# Altium project HE-PCB.PrjPcb
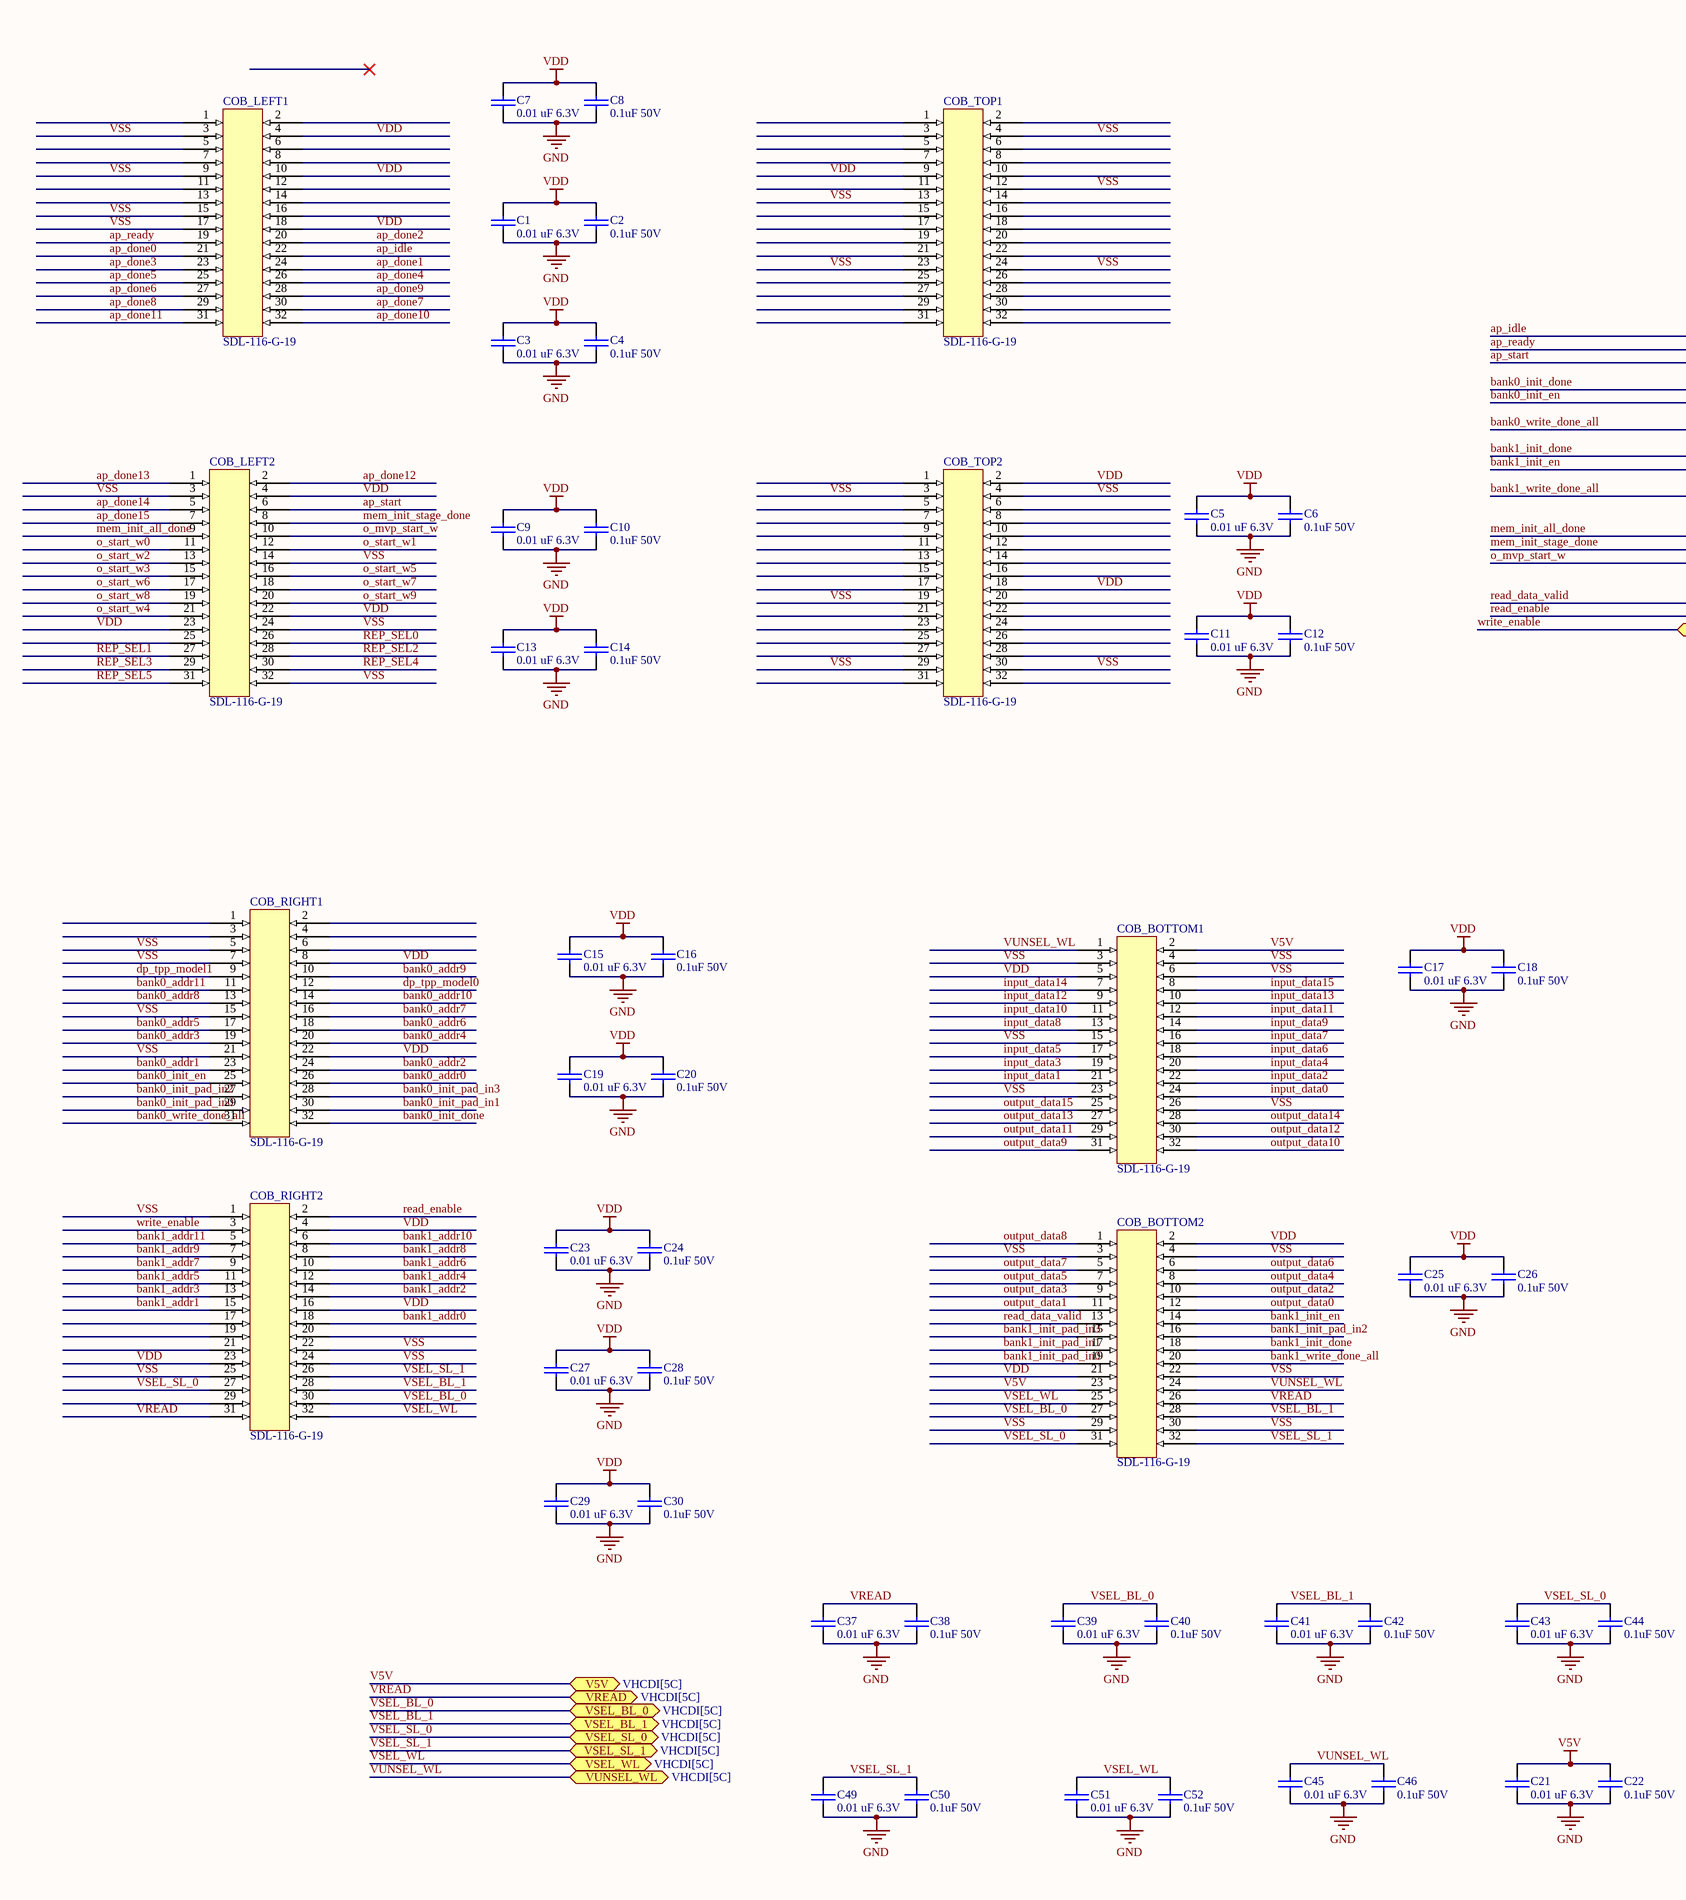
[diagram p0: COBConnector.SchDoc, left]
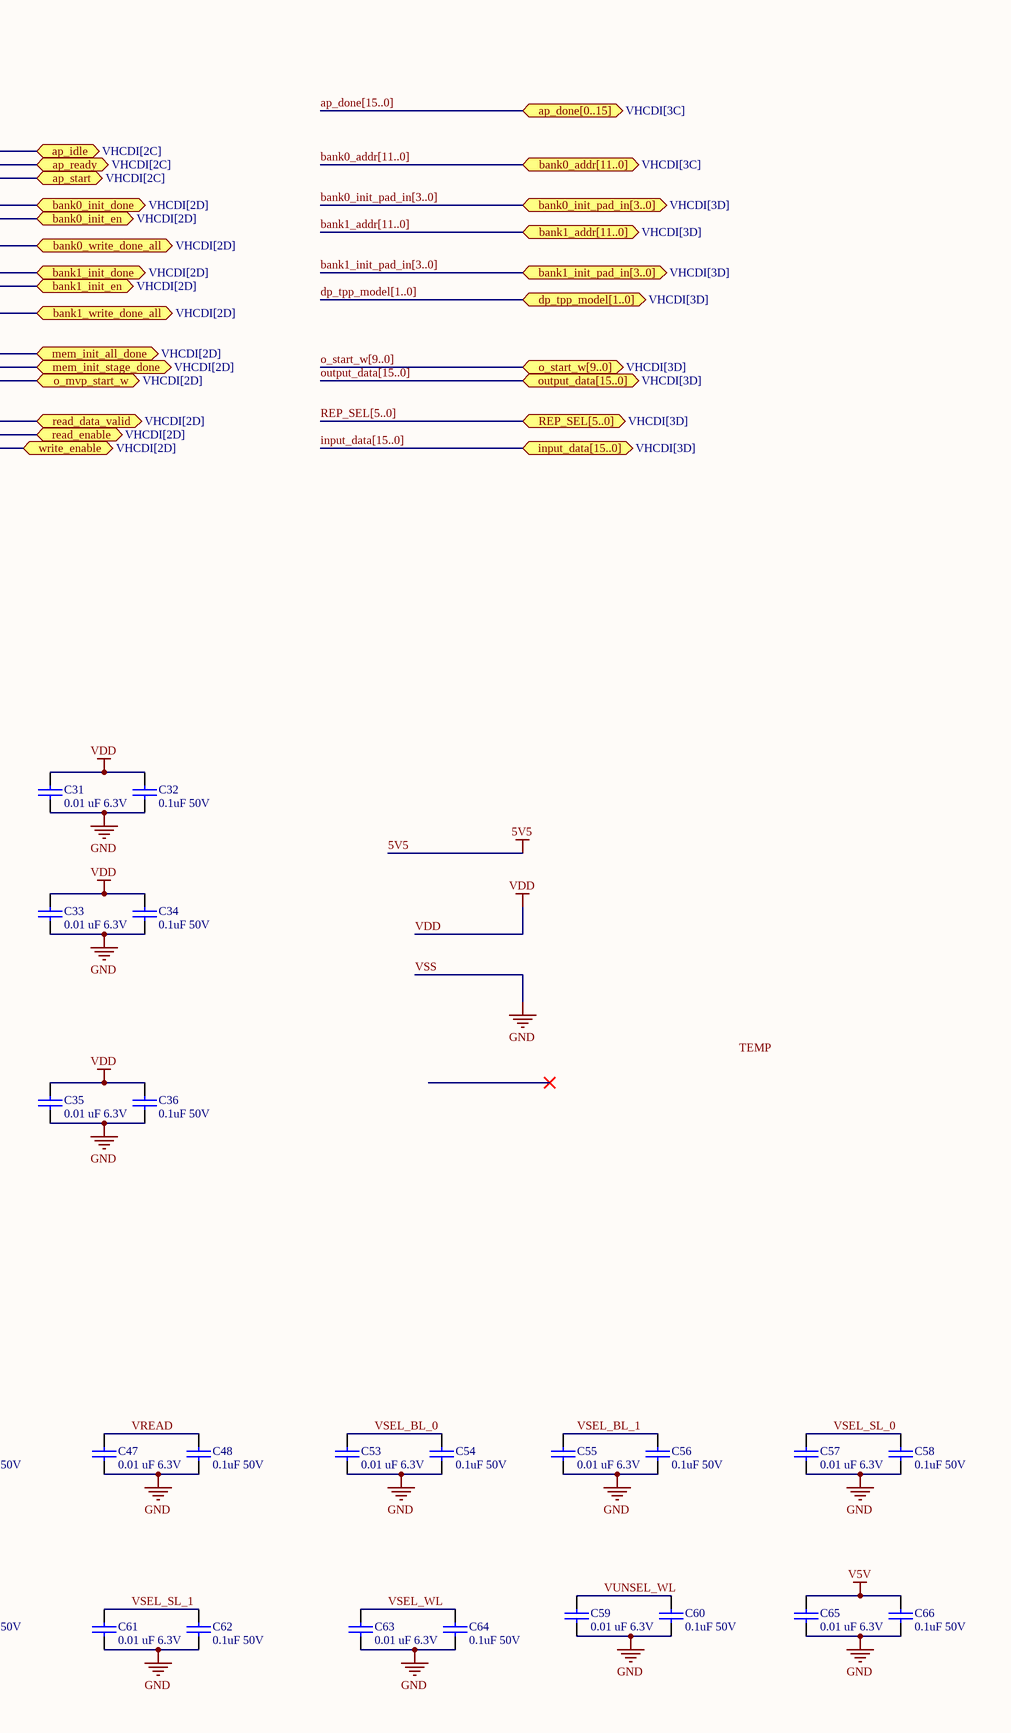
[diagram p1: COBConnector.SchDoc, right]
2 sheets, 79 parts. Net scope: flat (ports and power ports of the same name join across sheets).
Board file: HE.PcbDoc
Sheets:
  COBConnector.SchDoc
  VHCDI.SchDoc

## Sheet COBConnector.SchDoc
size C; SheetNumber: 1; SheetTotal: 2

### Parts
C1  0.01 uF 6.3V  [C0603-XXXXXX-XXX]
C2  0.1uF 50V  [C0603-XXXXXX-XXX]
C3  0.01 uF 6.3V  [C0603-XXXXXX-XXX]
C4  0.1uF 50V  [C0603-XXXXXX-XXX]
C5  0.01 uF 6.3V  [C0603-XXXXXX-XXX]
C6  0.1uF 50V  [C0603-XXXXXX-XXX]
C7  0.01 uF 6.3V  [C0603-XXXXXX-XXX]
C8  0.1uF 50V  [C0603-XXXXXX-XXX]
C9  0.01 uF 6.3V  [C0603-XXXXXX-XXX]
C10  0.1uF 50V  [C0603-XXXXXX-XXX]
C11  0.01 uF 6.3V  [C0603-XXXXXX-XXX]
C12  0.1uF 50V  [C0603-XXXXXX-XXX]
C13  0.01 uF 6.3V  [C0603-XXXXXX-XXX]
C14  0.1uF 50V  [C0603-XXXXXX-XXX]
C15  0.01 uF 6.3V  [C0603-XXXXXX-XXX]
C16  0.1uF 50V  [C0603-XXXXXX-XXX]
C17  0.01 uF 6.3V  [C0603-XXXXXX-XXX]
C18  0.1uF 50V  [C0603-XXXXXX-XXX]
C19  0.01 uF 6.3V  [C0603-XXXXXX-XXX]
C20  0.1uF 50V  [C0603-XXXXXX-XXX]
C21  0.01 uF 6.3V  [C0603-XXXXXX-XXX]
C22  0.1uF 50V  [C0603-XXXXXX-XXX]
C23  0.01 uF 6.3V  [C0603-XXXXXX-XXX]
C24  0.1uF 50V  [C0603-XXXXXX-XXX]
C25  0.01 uF 6.3V  [C0603-XXXXXX-XXX]
C26  0.1uF 50V  [C0603-XXXXXX-XXX]
C27  0.01 uF 6.3V  [C0603-XXXXXX-XXX]
C28  0.1uF 50V  [C0603-XXXXXX-XXX]
C29  0.01 uF 6.3V  [C0603-XXXXXX-XXX]
C30  0.1uF 50V  [C0603-XXXXXX-XXX]
C31  0.01 uF 6.3V  [C0603-XXXXXX-XXX]
C32  0.1uF 50V  [C0603-XXXXXX-XXX]
C33  0.01 uF 6.3V  [C0603-XXXXXX-XXX]
C34  0.1uF 50V  [C0603-XXXXXX-XXX]
C35  0.01 uF 6.3V  [C0603-XXXXXX-XXX]
C36  0.1uF 50V  [C0603-XXXXXX-XXX]
C37  0.01 uF 6.3V  [C0603-XXXXXX-XXX]
C38  0.1uF 50V  [C0603-XXXXXX-XXX]
C39  0.01 uF 6.3V  [C0603-XXXXXX-XXX]
C40  0.1uF 50V  [C0603-XXXXXX-XXX]
C41  0.01 uF 6.3V  [C0603-XXXXXX-XXX]
C42  0.1uF 50V  [C0603-XXXXXX-XXX]
C43  0.01 uF 6.3V  [C0603-XXXXXX-XXX]
C44  0.1uF 50V  [C0603-XXXXXX-XXX]
C45  0.01 uF 6.3V  [C0603-XXXXXX-XXX]
C46  0.1uF 50V  [C0603-XXXXXX-XXX]
C47  0.01 uF 6.3V  [C0603-XXXXXX-XXX]
C48  0.1uF 50V  [C0603-XXXXXX-XXX]
C49  0.01 uF 6.3V  [C0603-XXXXXX-XXX]
C50  0.1uF 50V  [C0603-XXXXXX-XXX]
C51  0.01 uF 6.3V  [C0603-XXXXXX-XXX]
C52  0.1uF 50V  [C0603-XXXXXX-XXX]
C53  0.01 uF 6.3V  [C0603-XXXXXX-XXX]
C54  0.1uF 50V  [C0603-XXXXXX-XXX]
C55  0.01 uF 6.3V  [C0603-XXXXXX-XXX]
C56  0.1uF 50V  [C0603-XXXXXX-XXX]
C57  0.01 uF 6.3V  [C0603-XXXXXX-XXX]
C58  0.1uF 50V  [C0603-XXXXXX-XXX]
C59  0.01 uF 6.3V  [C0603-XXXXXX-XXX]
C60  0.1uF 50V  [C0603-XXXXXX-XXX]
C61  0.01 uF 6.3V  [C0603-XXXXXX-XXX]
C62  0.1uF 50V  [C0603-XXXXXX-XXX]
C63  0.01 uF 6.3V  [C0603-XXXXXX-XXX]
C64  0.1uF 50V  [C0603-XXXXXX-XXX]
C65  0.01 uF 6.3V  [C0603-XXXXXX-XXX]
C66  0.1uF 50V  [C0603-XXXXXX-XXX]
COB_BOTTOM1  SDL-116-G-19  [CON32_2X16_TU_DSL_SAI]
COB_BOTTOM2  SDL-116-G-19  [CON32_2X16_TU_DSL_SAI]
COB_LEFT1  SDL-116-G-19  [CON32_2X16_TU_DSL_SAI]
COB_LEFT2  SDL-116-G-19  [CON32_2X16_TU_DSL_SAI]
COB_RIGHT1  SDL-116-G-19  [CON32_2X16_TU_DSL_SAI]
COB_RIGHT2  SDL-116-G-19  [CON32_2X16_TU_DSL_SAI]
COB_TOP1  SDL-116-G-19  [CON32_2X16_TU_DSL_SAI]
COB_TOP2  SDL-116-G-19  [CON32_2X16_TU_DSL_SAI]

### Ports
ap_done[0..15] (bidir, see VHCDI[3C]), ap_idle (bidir, see VHCDI[2C]), ap_ready (bidir, see VHCDI[2C]), ap_start (bidir, see VHCDI[2C]), bank0_addr[11..0] (bidir, see VHCDI[3C]), bank0_init_done (bidir, see VHCDI[2D]), bank0_init_en (bidir, see VHCDI[2D]), bank0_init_pad_in[3..0] (bidir, see VHCDI[3D]), bank0_write_done_all (bidir, see VHCDI[2D]), bank1_addr[11..0] (bidir, see VHCDI[3D]), bank1_init_done (bidir, see VHCDI[2D]), bank1_init_en (bidir, see VHCDI[2D]), bank1_init_pad_in[3..0] (bidir, see VHCDI[3D]), bank1_write_done_all (bidir, see VHCDI[2D]), dp_tpp_model[1..0] (bidir, see VHCDI[3D]), input_data[15..0] (bidir, see VHCDI[3D]), mem_init_all_done (bidir, see VHCDI[2D]), mem_init_stage_done (bidir, see VHCDI[2D]), o_mvp_start_w (bidir, see VHCDI[2D]), o_start_w[9..0] (bidir, see VHCDI[3D]), output_data[15..0] (bidir, see VHCDI[3D]), read_data_valid (bidir, see VHCDI[2D]), read_enable (bidir, see VHCDI[2D]), REP_SEL[5..0] (bidir, see VHCDI[3D]), V5V (bidir, see VHCDI[5C]), VREAD (bidir, see VHCDI[5C]), VSEL_BL_0 (bidir, see VHCDI[5C]), VSEL_BL_1 (bidir, see VHCDI[5C]), VSEL_SL_0 (bidir, see VHCDI[5C]), VSEL_SL_1 (bidir, see VHCDI[5C]), VSEL_WL (bidir, see VHCDI[5C]), VUNSEL_WL (bidir, see VHCDI[5C]), write_enable (bidir, see VHCDI[2D])

### Nets
V5V: C21.1 C22.1 C65.1 C66.1 COB_BOTTOM1.2 COB_BOTTOM2.23 ; port V5V
VDD: C1.1 C2.1 C3.1 C4.1 C5.1 C6.1 C7.1 C8.1 C9.1 C10.1 C11.1 C12.1 C13.1 C14.1 C15.1 C16.1 C17.1 C18.1 C19.1 C20.1 C23.1 C24.1 C25.1 C26.1 C27.1 C28.1 C29.1 C30.1 C31.1 C32.1 C33.1 C34.1 C35.1 C36.1 COB_BOTTOM1.5 COB_BOTTOM2.2 COB_BOTTOM2.21 COB_LEFT1.4 COB_LEFT1.10 COB_LEFT1.18 COB_LEFT2.4 COB_LEFT2.22 COB_LEFT2.23 COB_RIGHT1.8 COB_RIGHT1.22 COB_RIGHT2.4 COB_RIGHT2.16 COB_RIGHT2.23 COB_TOP1.9 COB_TOP2.2 COB_TOP2.18
VSS: C1.2 C2.2 C3.2 C4.2 C5.2 C6.2 C7.2 C8.2 C9.2 C10.2 C11.2 C12.2 C13.2 C14.2 C15.2 C16.2 C17.2 C18.2 C19.2 C20.2 C21.2 C22.2 C23.2 C24.2 C25.2 C26.2 C27.2 C28.2 C29.2 C30.2 C31.2 C32.2 C33.2 C34.2 C35.2 C36.2 C37.2 C38.2 C39.2 C40.2 C41.2 C42.2 C43.2 C44.2 C45.2 C46.2 C47.2 C48.2 C49.2 C50.2 C51.2 C52.2 C53.2 C54.2 C55.2 C56.2 C57.2 C58.2 C59.2 C60.2 C61.2 C62.2 C63.2 C64.2 C65.2 C66.2 COB_BOTTOM1.3 COB_BOTTOM1.4 COB_BOTTOM1.6 COB_BOTTOM1.15 COB_BOTTOM1.23 COB_BOTTOM1.26 COB_BOTTOM2.3 COB_BOTTOM2.4 COB_BOTTOM2.22 COB_BOTTOM2.29 COB_BOTTOM2.30 COB_LEFT1.3 COB_LEFT1.9 COB_LEFT1.15 COB_LEFT1.17 COB_LEFT2.3 COB_LEFT2.14 COB_LEFT2.24 COB_LEFT2.32 COB_RIGHT1.5 COB_RIGHT1.7 COB_RIGHT1.15 COB_RIGHT1.21 COB_RIGHT2.1 COB_RIGHT2.22 COB_RIGHT2.24 COB_RIGHT2.25 COB_TOP1.4 COB_TOP1.12 COB_TOP1.13 COB_TOP1.23 COB_TOP1.24 COB_TOP2.3 COB_TOP2.4 COB_TOP2.19 COB_TOP2.29 COB_TOP2.30  [also labelled GND]
ap_done0: COB_LEFT1.21
ap_done1: COB_LEFT1.24
ap_done2: COB_LEFT1.20
ap_done3: COB_LEFT1.23
ap_done4: COB_LEFT1.26
ap_done5: COB_LEFT1.25
ap_done6: COB_LEFT1.27
ap_done7: COB_LEFT1.30
ap_done8: COB_LEFT1.29
ap_done9: COB_LEFT1.28
ap_done10: COB_LEFT1.32
ap_done11: COB_LEFT1.31
ap_done12: COB_LEFT2.2
ap_done13: COB_LEFT2.1
ap_done14: COB_LEFT2.5
ap_done15: COB_LEFT2.7
ap_idle: COB_LEFT1.22 ; port ap_idle
ap_ready: COB_LEFT1.19 ; port ap_ready
ap_start: COB_LEFT2.6 ; port ap_start
bank0_addr0: COB_RIGHT1.26
bank0_addr1: COB_RIGHT1.23
bank0_addr2: COB_RIGHT1.24
bank0_addr3: COB_RIGHT1.19
bank0_addr4: COB_RIGHT1.20
bank0_addr5: COB_RIGHT1.17
bank0_addr6: COB_RIGHT1.18
bank0_addr7: COB_RIGHT1.16
bank0_addr8: COB_RIGHT1.13
bank0_addr9: COB_RIGHT1.10
bank0_addr10: COB_RIGHT1.14
bank0_addr11: COB_RIGHT1.11
bank0_init_done: COB_RIGHT1.32 ; port bank0_init_done
bank0_init_en: COB_RIGHT1.25 ; port bank0_init_en
bank0_init_pad_in0: COB_RIGHT1.29
bank0_init_pad_in1: COB_RIGHT1.30
bank0_init_pad_in2: COB_RIGHT1.27
bank0_init_pad_in3: COB_RIGHT1.28
bank0_write_done_all: COB_RIGHT1.31 ; port bank0_write_done_all
bank1_addr0: COB_RIGHT2.18
bank1_addr1: COB_RIGHT2.15
bank1_addr2: COB_RIGHT2.14
bank1_addr3: COB_RIGHT2.13
bank1_addr4: COB_RIGHT2.12
bank1_addr5: COB_RIGHT2.11
bank1_addr6: COB_RIGHT2.10
bank1_addr7: COB_RIGHT2.9
bank1_addr8: COB_RIGHT2.8
bank1_addr9: COB_RIGHT2.7
bank1_addr10: COB_RIGHT2.6
bank1_addr11: COB_RIGHT2.5
bank1_init_done: COB_BOTTOM2.18 ; port bank1_init_done
bank1_init_en: COB_BOTTOM2.14 ; port bank1_init_en
bank1_init_pad_in0: COB_BOTTOM2.19
bank1_init_pad_in1: COB_BOTTOM2.17
bank1_init_pad_in2: COB_BOTTOM2.16
bank1_init_pad_in3: COB_BOTTOM2.15
bank1_write_done_all: COB_BOTTOM2.20 ; port bank1_write_done_all
dp_tpp_model0: COB_RIGHT1.12
dp_tpp_model1: COB_RIGHT1.9
input_data0: COB_BOTTOM1.24
input_data1: COB_BOTTOM1.21
input_data2: COB_BOTTOM1.22
input_data3: COB_BOTTOM1.19
input_data4: COB_BOTTOM1.20
input_data5: COB_BOTTOM1.17
input_data6: COB_BOTTOM1.18
input_data7: COB_BOTTOM1.16
input_data8: COB_BOTTOM1.13
input_data9: COB_BOTTOM1.14
input_data10: COB_BOTTOM1.11
input_data11: COB_BOTTOM1.12
input_data12: COB_BOTTOM1.9
input_data13: COB_BOTTOM1.10
input_data14: COB_BOTTOM1.7
input_data15: COB_BOTTOM1.8
mem_init_all_done: COB_LEFT2.9 ; port mem_init_all_done
mem_init_stage_done: COB_LEFT2.8 ; port mem_init_stage_done
o_mvp_start_w: COB_LEFT2.10 ; port o_mvp_start_w
o_start_w0: COB_LEFT2.11
o_start_w1: COB_LEFT2.12
o_start_w2: COB_LEFT2.13
o_start_w3: COB_LEFT2.15
o_start_w4: COB_LEFT2.21
o_start_w5: COB_LEFT2.16
o_start_w6: COB_LEFT2.17
o_start_w7: COB_LEFT2.18
o_start_w8: COB_LEFT2.19
o_start_w9: COB_LEFT2.20
output_data0: COB_BOTTOM2.12
output_data1: COB_BOTTOM2.11
output_data2: COB_BOTTOM2.10
output_data3: COB_BOTTOM2.9
output_data4: COB_BOTTOM2.8
output_data5: COB_BOTTOM2.7
output_data6: COB_BOTTOM2.6
output_data7: COB_BOTTOM2.5
output_data8: COB_BOTTOM2.1
output_data9: COB_BOTTOM1.31
output_data10: COB_BOTTOM1.32
output_data11: COB_BOTTOM1.29
output_data12: COB_BOTTOM1.30
output_data13: COB_BOTTOM1.27
output_data14: COB_BOTTOM1.28
output_data15: COB_BOTTOM1.25
read_data_valid: COB_BOTTOM2.13 ; port read_data_valid
read_enable: COB_RIGHT2.2 ; port read_enable
REP_SEL0: COB_LEFT2.26
REP_SEL1: COB_LEFT2.27
REP_SEL2: COB_LEFT2.28
REP_SEL3: COB_LEFT2.29
REP_SEL4: COB_LEFT2.30
REP_SEL5: COB_LEFT2.31
VREAD: C37.1 C38.1 C47.1 C48.1 COB_BOTTOM2.26 COB_RIGHT2.31 ; port VREAD
VSEL_BL_0: C39.1 C40.1 C53.1 C54.1 COB_BOTTOM2.27 COB_RIGHT2.30 ; port VSEL_BL_0
VSEL_BL_1: C41.1 C42.1 C55.1 C56.1 COB_BOTTOM2.28 COB_RIGHT2.28 ; port VSEL_BL_1
VSEL_SL_0: C43.1 C44.1 C57.1 C58.1 COB_BOTTOM2.31 COB_RIGHT2.27 ; port VSEL_SL_0
VSEL_SL_1: C49.1 C50.1 C61.1 C62.1 COB_BOTTOM2.32 COB_RIGHT2.26 ; port VSEL_SL_1
VSEL_WL: C51.1 C52.1 C63.1 C64.1 COB_BOTTOM2.25 COB_RIGHT2.32 ; port VSEL_WL
VUNSEL_WL: C45.1 C46.1 C59.1 C60.1 COB_BOTTOM1.1 COB_BOTTOM2.24 ; port VUNSEL_WL
write_enable: COB_RIGHT2.3 ; port write_enable

Not connected (* = marked no-connect by the designer): COB_LEFT1 1 2 5 6 7 8 11 12 13 14 16; COB_LEFT2 25; COB_RIGHT1 1 2 3 4 6; COB_RIGHT2 17 19 20 21 29; COB_TOP1 1 2 3 5 6 7 8 10 11 14 15 16 17 18 19 20 21 22 25 26 27 28 29 30 31 32; COB_TOP2 1 5 6 7 8 9 10 11 12 13 14 15 16 17 20 21 22 23 24 25 26 27 28 31 32

### Buses and harness runs
bus ap_done[15..0] = port ap_done[0..15]
bus bank0_addr[11..0] = port bank0_addr[11..0]
bus bank0_init_pad_in[3..0] = port bank0_init_pad_in[3..0]
bus bank1_addr[11..0] = port bank1_addr[11..0]
bus bank1_init_pad_in[3..0] = port bank1_init_pad_in[3..0]
bus dp_tpp_model[1..0] = port dp_tpp_model[1..0]
bus input_data[15..0] = port input_data[15..0]
bus o_start_w[9..0] = port o_start_w[9..0]
bus output_data[15..0] = port output_data[15..0]
bus REP_SEL[5..0] = port REP_SEL[5..0]

### Notes on the sheet
- Labels drawn without touching a wire or pin: TEMP

### Library data of the parts
C1 C3 C5 C7 C9 C11 C13 C15 C17 C19 C21 C23 C25 C27 C29 C31 C33 C35 C37 C39 C41 C43 C45 C47 C49 C51 C53 C55 C57 C59 C61 C63 C65 = C0603F103M9RACTU: Multilayer Ceramic Capacitors MLCC - SMD/SMT 6.3V 0.01uF X7R 0603 20%; Value: 0.01 uF 6.3V
C2 C4 C6 C8 C10 C12 C14 C16 C18 C20 C22 C24 C26 C28 C30 C32 C34 C36 C38 C40 C42 C44 C46 C48 C50 C52 C54 C56 C58 C60 C62 C64 C66 = C0603C104M5RAC7867: 0.1 µF ±20% 50V Ceramic Capacitor X7R 0603; KMI: 821327; Value: 0.1uF 50V

## Sheet VHCDI.SchDoc
size C; SheetNumber: 2; SheetTotal: 2
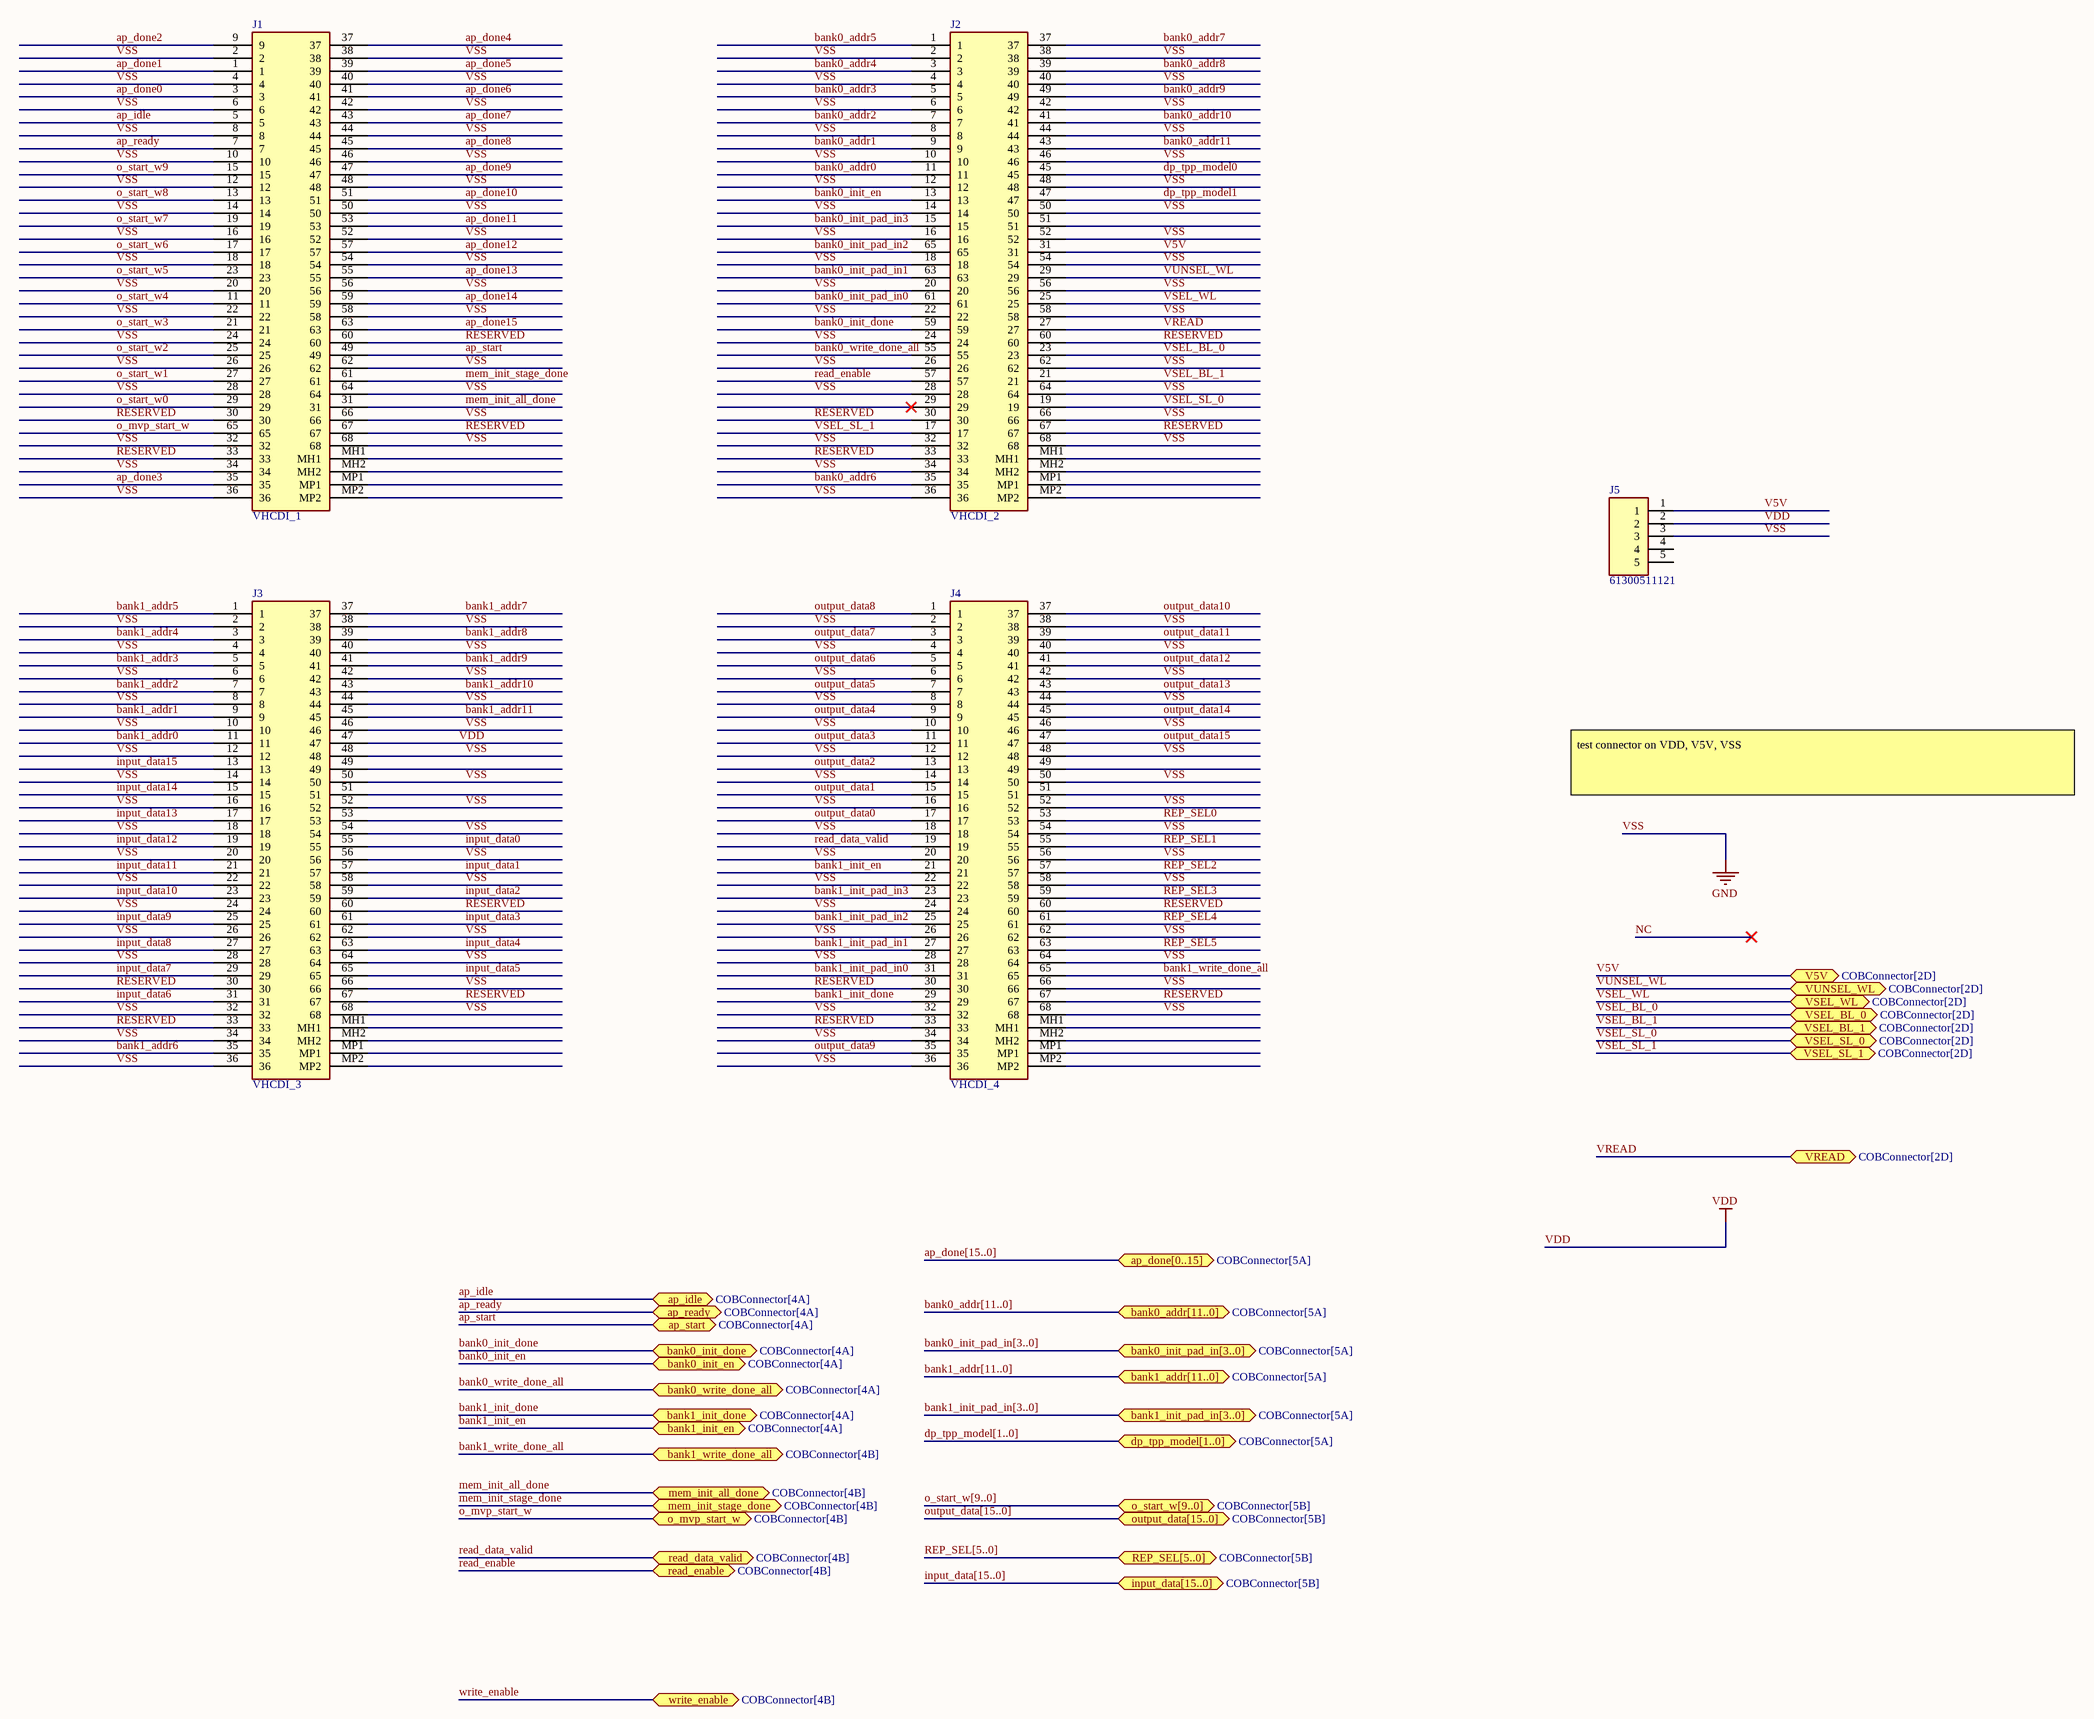
[diagram p2: VHCDI.SchDoc]

### Parts
J1  VHCDI_1  [CONN68_HDRA-EC_HON]
J2  VHCDI_2  [CONN68_HDRA-EC_HON]
J3  VHCDI_3  [CONN68_HDRA-EC_HON]
J4  VHCDI_4  [CONN68_HDRA-EC_HON]
J5  61300511121  [HDRV5W64P0X254_1X5_1270X254X854P]

### Ports
ap_done[0..15] (bidir, see COBConnector[5A]), ap_idle (bidir, see COBConnector[4A]), ap_ready (bidir, see COBConnector[4A]), ap_start (bidir, see COBConnector[4A]), bank0_addr[11..0] (bidir, see COBConnector[5A]), bank0_init_done (bidir, see COBConnector[4A]), bank0_init_en (bidir, see COBConnector[4A]), bank0_init_pad_in[3..0] (bidir, see COBConnector[5A]), bank0_write_done_all (bidir, see COBConnector[4A]), bank1_addr[11..0] (bidir, see COBConnector[5A]), bank1_init_done (bidir, see COBConnector[4A]), bank1_init_en (bidir, see COBConnector[4A]), bank1_init_pad_in[3..0] (bidir, see COBConnector[5A]), bank1_write_done_all (bidir, see COBConnector[4B]), dp_tpp_model[1..0] (bidir, see COBConnector[5A]), input_data[15..0] (bidir, see COBConnector[5B]), mem_init_all_done (bidir, see COBConnector[4B]), mem_init_stage_done (bidir, see COBConnector[4B]), o_mvp_start_w (bidir, see COBConnector[4B]), o_start_w[9..0] (bidir, see COBConnector[5B]), output_data[15..0] (bidir, see COBConnector[5B]), read_data_valid (bidir, see COBConnector[4B]), read_enable (bidir, see COBConnector[4B]), REP_SEL[5..0] (bidir, see COBConnector[5B]), V5V (bidir, see COBConnector[2D]), VREAD (bidir, see COBConnector[2D]), VSEL_BL_0 (bidir, see COBConnector[2D]), VSEL_BL_1 (bidir, see COBConnector[2D]), VSEL_SL_0 (bidir, see COBConnector[2D]), VSEL_SL_1 (bidir, see COBConnector[2D]), VSEL_WL (bidir, see COBConnector[2D]), VUNSEL_WL (bidir, see COBConnector[2D]), write_enable (bidir, see COBConnector[4B])

### Nets
V5V: J2.31 J5.1 ; port V5V
VDD: J3.47 J5.2
VSS: J1.2 J1.4 J1.6 J1.8 J1.10 J1.12 J1.14 J1.16 J1.18 J1.20 J1.22 J1.24 J1.26 J1.28 J1.32 J1.34 J1.36 J1.38 J1.40 J1.42 J1.44 J1.46 J1.48 J1.50 J1.52 J1.54 J1.56 J1.58 J1.62 J1.64 J1.66 J1.68 J2.2 J2.4 J2.6 J2.8 J2.10 J2.12 J2.14 J2.16 J2.18 J2.20 J2.22 J2.24 J2.26 J2.28 J2.32 J2.34 J2.36 J2.38 J2.40 J2.42 J2.44 J2.46 J2.48 J2.50 J2.52 J2.54 J2.56 J2.58 J2.62 J2.64 J2.66 J2.68 J3.2 J3.4 J3.6 J3.8 J3.10 J3.12 J3.14 J3.16 J3.18 J3.20 J3.22 J3.24 J3.26 J3.28 J3.32 J3.34 J3.36 J3.38 J3.40 J3.42 J3.44 J3.46 J3.48 J3.50 J3.52 J3.54 J3.56 J3.58 J3.62 J3.64 J3.66 J3.68 J4.2 J4.4 J4.6 J4.8 J4.10 J4.12 J4.14 J4.16 J4.18 J4.20 J4.22 J4.24 J4.26 J4.28 J4.32 J4.34 J4.36 J4.38 J4.40 J4.42 J4.44 J4.46 J4.48 J4.50 J4.52 J4.54 J4.56 J4.58 J4.62 J4.64 J4.66 J4.68 J5.3  [also labelled GND]
ap_done0: J1.3
ap_done1: J1.1
ap_done2: J1.9
ap_done3: J1.35
ap_done4: J1.37
ap_done5: J1.39
ap_done6: J1.41
ap_done7: J1.43
ap_done8: J1.45
ap_done9: J1.47
ap_done10: J1.51
ap_done11: J1.53
ap_done12: J1.57
ap_done13: J1.55
ap_done14: J1.59
ap_done15: J1.63
ap_idle: J1.5 ; port ap_idle
ap_ready: J1.7 ; port ap_ready
ap_start: J1.49 ; port ap_start
bank0_addr0: J2.11
bank0_addr1: J2.9
bank0_addr2: J2.7
bank0_addr3: J2.5
bank0_addr4: J2.3
bank0_addr5: J2.1
bank0_addr6: J2.35
bank0_addr7: J2.37
bank0_addr8: J2.39
bank0_addr9: J2.49
bank0_addr10: J2.41
bank0_addr11: J2.43
bank0_init_done: J2.59 ; port bank0_init_done
bank0_init_en: J2.13 ; port bank0_init_en
bank0_init_pad_in0: J2.61
bank0_init_pad_in1: J2.63
bank0_init_pad_in2: J2.65
bank0_init_pad_in3: J2.15
bank0_write_done_all: J2.55 ; port bank0_write_done_all
bank1_addr0: J3.11
bank1_addr1: J3.9
bank1_addr2: J3.7
bank1_addr3: J3.5
bank1_addr4: J3.3
bank1_addr5: J3.1
bank1_addr6: J3.35
bank1_addr7: J3.37
bank1_addr8: J3.39
bank1_addr9: J3.41
bank1_addr10: J3.43
bank1_addr11: J3.45
bank1_init_done: J4.29 ; port bank1_init_done
bank1_init_en: J4.21 ; port bank1_init_en
bank1_init_pad_in0: J4.31
bank1_init_pad_in1: J4.27
bank1_init_pad_in2: J4.25
bank1_init_pad_in3: J4.23
bank1_write_done_all: J4.65 ; port bank1_write_done_all
dp_tpp_model0: J2.45
dp_tpp_model1: J2.47
input_data0: J3.55
input_data1: J3.57
input_data2: J3.59
input_data3: J3.61
input_data4: J3.63
input_data5: J3.65
input_data6: J3.31
input_data7: J3.29
input_data8: J3.27
input_data9: J3.25
input_data10: J3.23
input_data11: J3.21
input_data12: J3.19
input_data13: J3.17
input_data14: J3.15
input_data15: J3.13
mem_init_all_done: J1.31 ; port mem_init_all_done
mem_init_stage_done: J1.61 ; port mem_init_stage_done
o_mvp_start_w: J1.65 ; port o_mvp_start_w
o_start_w0: J1.29
o_start_w1: J1.27
o_start_w2: J1.25
o_start_w3: J1.21
o_start_w4: J1.11
o_start_w5: J1.23
o_start_w6: J1.17
o_start_w7: J1.19
o_start_w8: J1.13
o_start_w9: J1.15
output_data0: J4.17
output_data1: J4.15
output_data2: J4.13
output_data3: J4.11
output_data4: J4.9
output_data5: J4.7
output_data6: J4.5
output_data7: J4.3
output_data8: J4.1
output_data9: J4.35
output_data10: J4.37
output_data11: J4.39
output_data12: J4.41
output_data13: J4.43
output_data14: J4.45
output_data15: J4.47
read_data_valid: J4.19 ; port read_data_valid
read_enable: J2.57 ; port read_enable
REP_SEL0: J4.53
REP_SEL1: J4.55
REP_SEL2: J4.57
REP_SEL3: J4.59
REP_SEL4: J4.61
REP_SEL5: J4.63
RESERVED: J1.30 J1.33 J1.60 J1.67 J2.30 J2.33 J2.60 J2.67 J3.30 J3.33 J3.60 J3.67 J4.30 J4.33 J4.60 J4.67
VREAD: J2.27 ; port VREAD
VSEL_BL_0: J2.23 ; port VSEL_BL_0
VSEL_BL_1: J2.21 ; port VSEL_BL_1
VSEL_SL_0: J2.19 ; port VSEL_SL_0
VSEL_SL_1: J2.17 ; port VSEL_SL_1
VSEL_WL: J2.25 ; port VSEL_WL
VUNSEL_WL: J2.29 ; port VUNSEL_WL

Not connected (* = marked no-connect by the designer): J1 MH1 MH2 MP1 MP2; J2 51 MH1 MH2 MP1 MP2; J3 49 51 53 MH1 MH2 MP1 MP2; J4 49 51 MH1 MH2 MP1 MP2; J5 4 5

### Buses and harness runs
bus ap_done[15..0] = port ap_done[0..15]
bus bank0_addr[11..0] = port bank0_addr[11..0]
bus bank0_init_pad_in[3..0] = port bank0_init_pad_in[3..0]
bus bank1_addr[11..0] = port bank1_addr[11..0]
bus bank1_init_pad_in[3..0] = port bank1_init_pad_in[3..0]
bus dp_tpp_model[1..0] = port dp_tpp_model[1..0]
bus input_data[15..0] = port input_data[15..0]
bus o_start_w[9..0] = port o_start_w[9..0]
bus output_data[15..0] = port output_data[15..0]
bus REP_SEL[5..0] = port REP_SEL[5..0]

### Notes on the sheet
- test connector on VDD, V5V, VSS

### Library data of the parts
J1-J4 = 785633-01: Connector; Manufacturer_Name: NI; Datasheet Link: https://www.digikey.com/en/products/detail/ni/785633-01/16637125?s=N4IgTCBcDaIOwA4CsA2AzGkBdAvkA; Height: 10.8mm; Manufacturer_Part_Number: 785633-01
J5 = 61300511121: Connector; Manufacturer_Name: Wurth Elektronik; Datasheet Link: http://katalog.we-online.de/em/datasheet/6130xx11121.pdf; Height: 8.54mm; Manufacturer_Part_Number: 61300511121; Mouser Part Number: 710-61300511121; Mouser Price/Stock: https://www.mouser.co.uk/ProductDetail/Wurth-Elektronik/61300511121?qs=PhR8RmCirEZCsCRHq%252BvfRQ%3D%3D

## Nets that join several sheets
V5V: COBConnector (6 pins), VHCDI (J2.31 J5.1)
VDD: COBConnector (51 pins), VHCDI (J3.47 J5.2)
VSS: COBConnector (103 pins), VHCDI (129 pins)
ap_done0: COBConnector (COB_LEFT1.21), VHCDI (J1.3)
ap_done1: COBConnector (COB_LEFT1.24), VHCDI (J1.1)
ap_done2: COBConnector (COB_LEFT1.20), VHCDI (J1.9)
ap_done3: COBConnector (COB_LEFT1.23), VHCDI (J1.35)
ap_done4: COBConnector (COB_LEFT1.26), VHCDI (J1.37)
ap_done5: COBConnector (COB_LEFT1.25), VHCDI (J1.39)
ap_done6: COBConnector (COB_LEFT1.27), VHCDI (J1.41)
ap_done7: COBConnector (COB_LEFT1.30), VHCDI (J1.43)
ap_done8: COBConnector (COB_LEFT1.29), VHCDI (J1.45)
ap_done9: COBConnector (COB_LEFT1.28), VHCDI (J1.47)
ap_done10: COBConnector (COB_LEFT1.32), VHCDI (J1.51)
ap_done11: COBConnector (COB_LEFT1.31), VHCDI (J1.53)
ap_done12: COBConnector (COB_LEFT2.2), VHCDI (J1.57)
ap_done13: COBConnector (COB_LEFT2.1), VHCDI (J1.55)
ap_done14: COBConnector (COB_LEFT2.5), VHCDI (J1.59)
ap_done15: COBConnector (COB_LEFT2.7), VHCDI (J1.63)
ap_idle: COBConnector (COB_LEFT1.22), VHCDI (J1.5)
ap_ready: COBConnector (COB_LEFT1.19), VHCDI (J1.7)
ap_start: COBConnector (COB_LEFT2.6), VHCDI (J1.49)
bank0_addr0: COBConnector (COB_RIGHT1.26), VHCDI (J2.11)
bank0_addr1: COBConnector (COB_RIGHT1.23), VHCDI (J2.9)
bank0_addr2: COBConnector (COB_RIGHT1.24), VHCDI (J2.7)
bank0_addr3: COBConnector (COB_RIGHT1.19), VHCDI (J2.5)
bank0_addr4: COBConnector (COB_RIGHT1.20), VHCDI (J2.3)
bank0_addr5: COBConnector (COB_RIGHT1.17), VHCDI (J2.1)
bank0_addr6: COBConnector (COB_RIGHT1.18), VHCDI (J2.35)
bank0_addr7: COBConnector (COB_RIGHT1.16), VHCDI (J2.37)
bank0_addr8: COBConnector (COB_RIGHT1.13), VHCDI (J2.39)
bank0_addr9: COBConnector (COB_RIGHT1.10), VHCDI (J2.49)
bank0_addr10: COBConnector (COB_RIGHT1.14), VHCDI (J2.41)
bank0_addr11: COBConnector (COB_RIGHT1.11), VHCDI (J2.43)
bank0_init_done: COBConnector (COB_RIGHT1.32), VHCDI (J2.59)
bank0_init_en: COBConnector (COB_RIGHT1.25), VHCDI (J2.13)
bank0_init_pad_in0: COBConnector (COB_RIGHT1.29), VHCDI (J2.61)
bank0_init_pad_in1: COBConnector (COB_RIGHT1.30), VHCDI (J2.63)
bank0_init_pad_in2: COBConnector (COB_RIGHT1.27), VHCDI (J2.65)
bank0_init_pad_in3: COBConnector (COB_RIGHT1.28), VHCDI (J2.15)
bank0_write_done_all: COBConnector (COB_RIGHT1.31), VHCDI (J2.55)
bank1_addr0: COBConnector (COB_RIGHT2.18), VHCDI (J3.11)
bank1_addr1: COBConnector (COB_RIGHT2.15), VHCDI (J3.9)
bank1_addr2: COBConnector (COB_RIGHT2.14), VHCDI (J3.7)
bank1_addr3: COBConnector (COB_RIGHT2.13), VHCDI (J3.5)
bank1_addr4: COBConnector (COB_RIGHT2.12), VHCDI (J3.3)
bank1_addr5: COBConnector (COB_RIGHT2.11), VHCDI (J3.1)
bank1_addr6: COBConnector (COB_RIGHT2.10), VHCDI (J3.35)
bank1_addr7: COBConnector (COB_RIGHT2.9), VHCDI (J3.37)
bank1_addr8: COBConnector (COB_RIGHT2.8), VHCDI (J3.39)
bank1_addr9: COBConnector (COB_RIGHT2.7), VHCDI (J3.41)
bank1_addr10: COBConnector (COB_RIGHT2.6), VHCDI (J3.43)
bank1_addr11: COBConnector (COB_RIGHT2.5), VHCDI (J3.45)
bank1_init_done: COBConnector (COB_BOTTOM2.18), VHCDI (J4.29)
bank1_init_en: COBConnector (COB_BOTTOM2.14), VHCDI (J4.21)
bank1_init_pad_in0: COBConnector (COB_BOTTOM2.19), VHCDI (J4.31)
bank1_init_pad_in1: COBConnector (COB_BOTTOM2.17), VHCDI (J4.27)
bank1_init_pad_in2: COBConnector (COB_BOTTOM2.16), VHCDI (J4.25)
bank1_init_pad_in3: COBConnector (COB_BOTTOM2.15), VHCDI (J4.23)
bank1_write_done_all: COBConnector (COB_BOTTOM2.20), VHCDI (J4.65)
dp_tpp_model0: COBConnector (COB_RIGHT1.12), VHCDI (J2.45)
dp_tpp_model1: COBConnector (COB_RIGHT1.9), VHCDI (J2.47)
input_data0: COBConnector (COB_BOTTOM1.24), VHCDI (J3.55)
input_data1: COBConnector (COB_BOTTOM1.21), VHCDI (J3.57)
input_data2: COBConnector (COB_BOTTOM1.22), VHCDI (J3.59)
input_data3: COBConnector (COB_BOTTOM1.19), VHCDI (J3.61)
input_data4: COBConnector (COB_BOTTOM1.20), VHCDI (J3.63)
input_data5: COBConnector (COB_BOTTOM1.17), VHCDI (J3.65)
input_data6: COBConnector (COB_BOTTOM1.18), VHCDI (J3.31)
input_data7: COBConnector (COB_BOTTOM1.16), VHCDI (J3.29)
input_data8: COBConnector (COB_BOTTOM1.13), VHCDI (J3.27)
input_data9: COBConnector (COB_BOTTOM1.14), VHCDI (J3.25)
input_data10: COBConnector (COB_BOTTOM1.11), VHCDI (J3.23)
input_data11: COBConnector (COB_BOTTOM1.12), VHCDI (J3.21)
input_data12: COBConnector (COB_BOTTOM1.9), VHCDI (J3.19)
input_data13: COBConnector (COB_BOTTOM1.10), VHCDI (J3.17)
input_data14: COBConnector (COB_BOTTOM1.7), VHCDI (J3.15)
input_data15: COBConnector (COB_BOTTOM1.8), VHCDI (J3.13)
mem_init_all_done: COBConnector (COB_LEFT2.9), VHCDI (J1.31)
mem_init_stage_done: COBConnector (COB_LEFT2.8), VHCDI (J1.61)
o_mvp_start_w: COBConnector (COB_LEFT2.10), VHCDI (J1.65)
o_start_w0: COBConnector (COB_LEFT2.11), VHCDI (J1.29)
o_start_w1: COBConnector (COB_LEFT2.12), VHCDI (J1.27)
o_start_w2: COBConnector (COB_LEFT2.13), VHCDI (J1.25)
o_start_w3: COBConnector (COB_LEFT2.15), VHCDI (J1.21)
o_start_w4: COBConnector (COB_LEFT2.21), VHCDI (J1.11)
o_start_w5: COBConnector (COB_LEFT2.16), VHCDI (J1.23)
o_start_w6: COBConnector (COB_LEFT2.17), VHCDI (J1.17)
o_start_w7: COBConnector (COB_LEFT2.18), VHCDI (J1.19)
o_start_w8: COBConnector (COB_LEFT2.19), VHCDI (J1.13)
o_start_w9: COBConnector (COB_LEFT2.20), VHCDI (J1.15)
output_data0: COBConnector (COB_BOTTOM2.12), VHCDI (J4.17)
output_data1: COBConnector (COB_BOTTOM2.11), VHCDI (J4.15)
output_data2: COBConnector (COB_BOTTOM2.10), VHCDI (J4.13)
output_data3: COBConnector (COB_BOTTOM2.9), VHCDI (J4.11)
output_data4: COBConnector (COB_BOTTOM2.8), VHCDI (J4.9)
output_data5: COBConnector (COB_BOTTOM2.7), VHCDI (J4.7)
output_data6: COBConnector (COB_BOTTOM2.6), VHCDI (J4.5)
output_data7: COBConnector (COB_BOTTOM2.5), VHCDI (J4.3)
output_data8: COBConnector (COB_BOTTOM2.1), VHCDI (J4.1)
output_data9: COBConnector (COB_BOTTOM1.31), VHCDI (J4.35)
output_data10: COBConnector (COB_BOTTOM1.32), VHCDI (J4.37)
output_data11: COBConnector (COB_BOTTOM1.29), VHCDI (J4.39)
output_data12: COBConnector (COB_BOTTOM1.30), VHCDI (J4.41)
output_data13: COBConnector (COB_BOTTOM1.27), VHCDI (J4.43)
output_data14: COBConnector (COB_BOTTOM1.28), VHCDI (J4.45)
output_data15: COBConnector (COB_BOTTOM1.25), VHCDI (J4.47)
read_data_valid: COBConnector (COB_BOTTOM2.13), VHCDI (J4.19)
read_enable: COBConnector (COB_RIGHT2.2), VHCDI (J2.57)
REP_SEL0: COBConnector (COB_LEFT2.26), VHCDI (J4.53)
REP_SEL1: COBConnector (COB_LEFT2.27), VHCDI (J4.55)
REP_SEL2: COBConnector (COB_LEFT2.28), VHCDI (J4.57)
REP_SEL3: COBConnector (COB_LEFT2.29), VHCDI (J4.59)
REP_SEL4: COBConnector (COB_LEFT2.30), VHCDI (J4.61)
REP_SEL5: COBConnector (COB_LEFT2.31), VHCDI (J4.63)
VREAD: COBConnector (6 pins), VHCDI (J2.27)
VSEL_BL_0: COBConnector (6 pins), VHCDI (J2.23)
VSEL_BL_1: COBConnector (6 pins), VHCDI (J2.21)
VSEL_SL_0: COBConnector (6 pins), VHCDI (J2.19)
VSEL_SL_1: COBConnector (6 pins), VHCDI (J2.17)
VSEL_WL: COBConnector (6 pins), VHCDI (J2.25)
VUNSEL_WL: COBConnector (6 pins), VHCDI (J2.29)